# EAGLE design eNode3 (EAGLE 7.2.0)
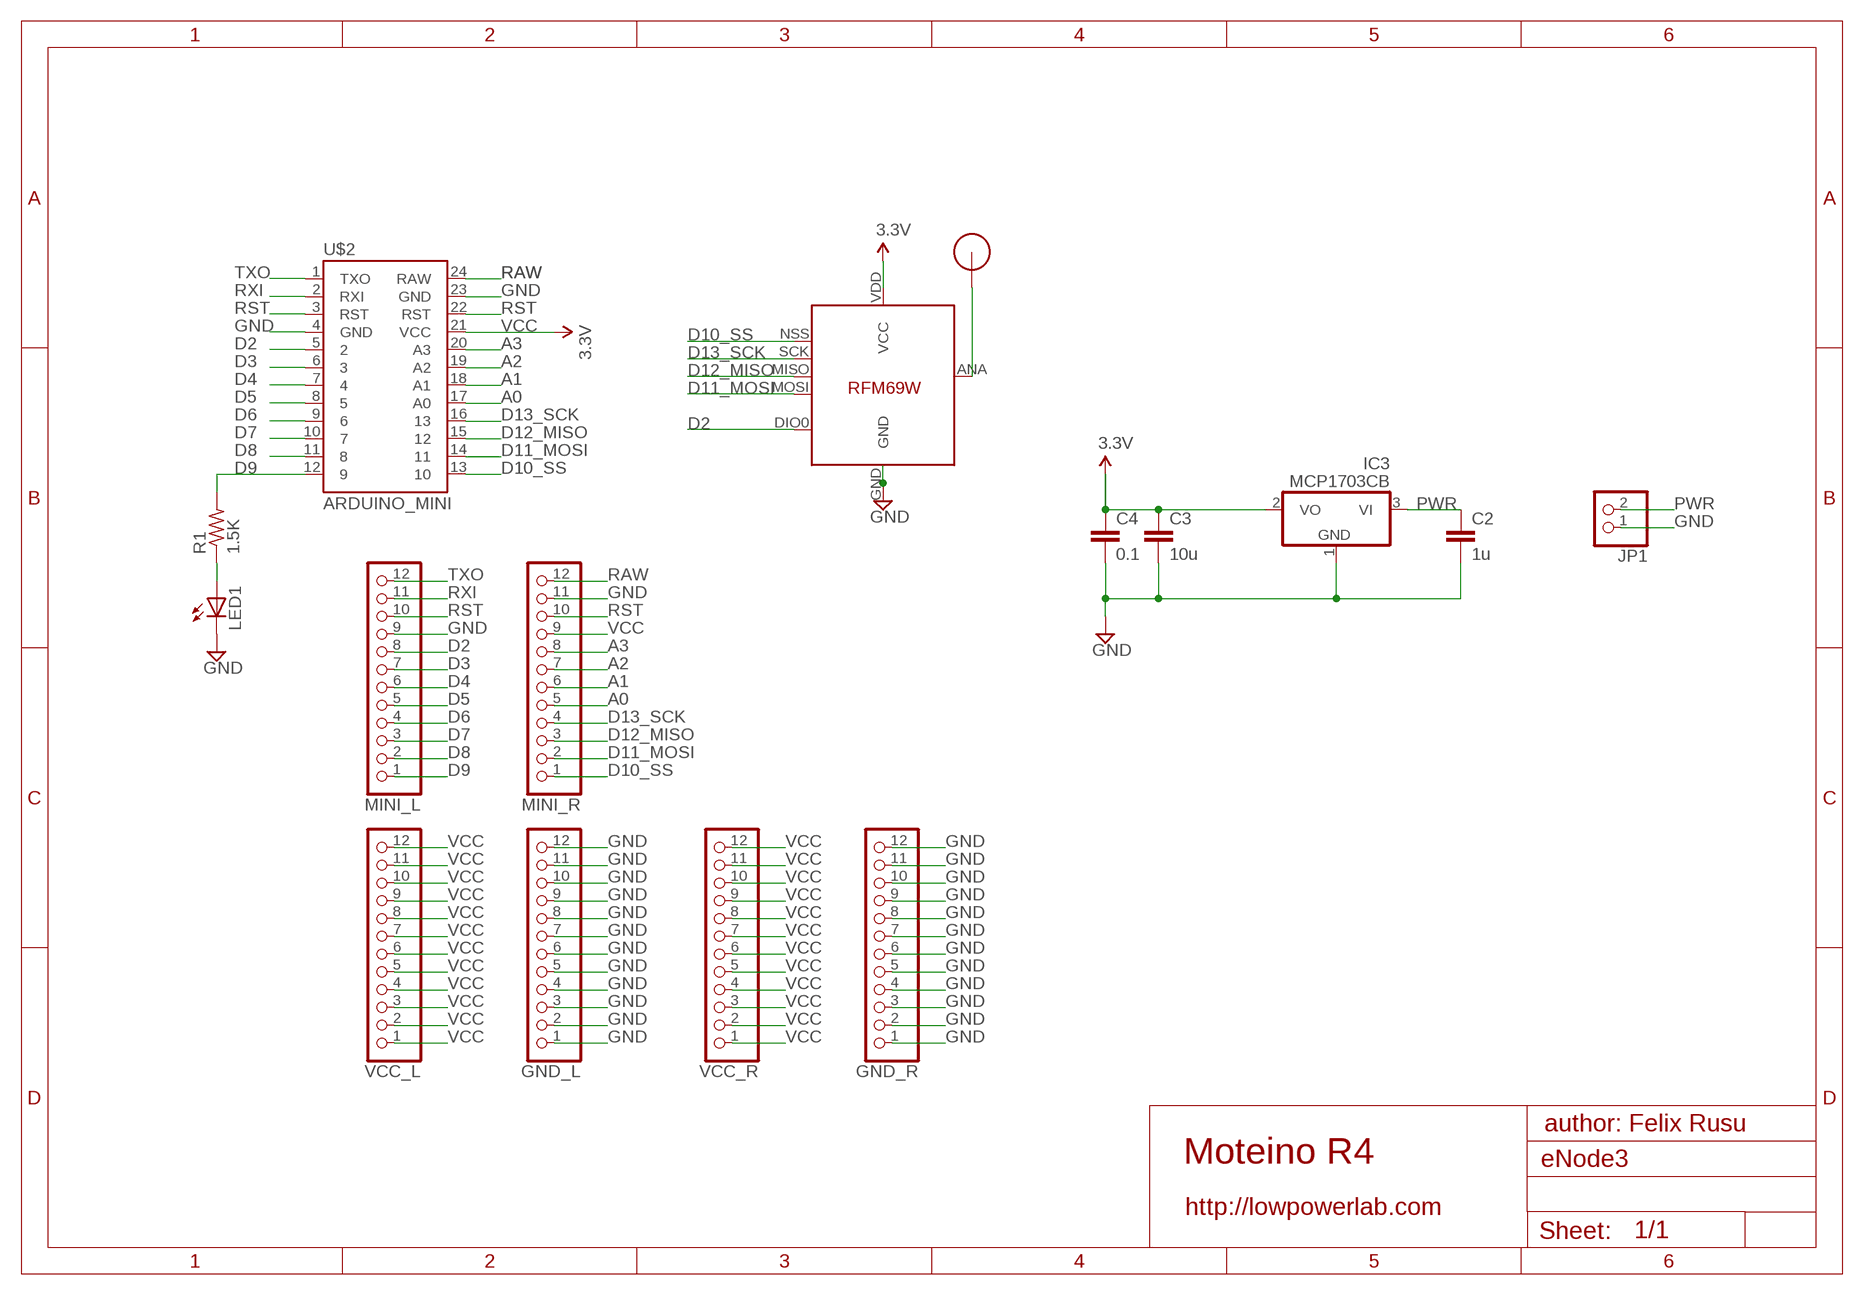
[diagram p0: schematic, sheet 1]

## Parts
C2  1u  CAP0603-CAP  [0603-CAP]
C3  10u  CAP0805-CAP  [0805-CAP]
C4  0.1  CAP0603-CAP  [0603-CAP]
GND_L  PINHD-1X12-CB  [1X12-CB]
GND_R  PINHD-1X12-CB  [1X12-CB]
IC3  MCP1703CB  [SOT23]
JP1  PINHD-1X2  [1X02]
LED1  LED3MM  [LED3MM]
MINI_L  PINHD-1X12-CB  [1X12-CB]
MINI_R  PINHD-1X12-CB  [1X12-CB]
R1  1.5K  R-US_R0805  [R0805]
U$1  RFM12B_ANTENNA  [RFM12B-ANTENNA]
U$2  ARDUINO_MINI  [ARDUINO_MINI]
U$5  RFM69  [RFM69W-MINPADS]
VCC_L  PINHD-1X12-CB  [1X12-CB]
VCC_R  PINHD-1X12-CB  [1X12-CB]

## Nets
A0: MINI_R.5 U$2.17(A0)
A1: MINI_R.6 U$2.18(A1)
A2: MINI_R.7 U$2.19(A2)
A3: MINI_R.8 U$2.20(A3)
D2: MINI_L.8 U$2.5 U$5.DIO0
D3: MINI_L.7 U$2.6
D4: MINI_L.6 U$2.7
D5: MINI_L.5 U$2.8
D6: MINI_L.4 U$2.9
D7: MINI_L.3 U$2.10
D8: MINI_L.2 U$2.11
D9: MINI_L.1 R1.2 U$2.12
D10_SS: MINI_R.1 U$2.13 U$5.NSS(SEL)
D11_MOSI: MINI_R.2 U$2.14 U$5.MOSI
D12_MISO: MINI_R.3 U$2.15 U$5.MISO
D13_SCK: MINI_R.4 U$2.16 U$5.SCK
GND [power]: C2.2 C3.2 C4.2 GND_L.1 GND_L.2 GND_L.3 GND_L.4 GND_L.5 GND_L.6 GND_L.7 GND_L.8 GND_L.9 GND_L.10 GND_L.11 GND_L.12 GND_R.1 GND_R.2 GND_R.3 GND_R.4 GND_R.5 GND_R.6 GND_R.7 GND_R.8 GND_R.9 GND_R.10 GND_R.11 GND_R.12 IC3.1(GND) JP1.1 LED1.K(C) MINI_L.9 MINI_R.11 U$2.4(GND) U$2.23(GND) U$5.GND
N$1: LED1.A R1.1
N$3: U$1.P$1 U$5.ANA(ANT)
PWR [power]: C2.1 IC3.3(VI) JP1.2
RAW: MINI_R.12 U$2.24(RAW)
RST: MINI_L.10 MINI_R.10 U$2.3(RST) U$2.22(RST)
RXI: MINI_L.11 U$2.2(RXI)
TXO: MINI_L.12 U$2.1(TXO)
VCC: C3.1 C4.1 IC3.2(VO) MINI_R.9 U$2.21(VCC) U$5.VDD(VCC) VCC_L.1 VCC_L.2 VCC_L.3 VCC_L.4 VCC_L.5 VCC_L.6 VCC_L.7 VCC_L.8 VCC_L.9 VCC_L.10 VCC_L.11 VCC_L.12 VCC_R.1 VCC_R.2 VCC_R.3 VCC_R.4 VCC_R.5 VCC_R.6 VCC_R.7 VCC_R.8 VCC_R.9 VCC_R.10 VCC_R.11 VCC_R.12 ; supply symbol labelled 3.3V

## Notes on the sheet
- author: Felix Rusu
- Moteino R4
- http://lowpowerlab.com

## Library data of the parts
C2-C4 = LowPowerLab:CAP: Capacitor Standard 0603 ceramic capacitor, and 0.1" leaded capacitor.
GND_L GND_R MINI_L MINI_R VCC_L VCC_R = adafruit:PINHD-1X12: PIN HEADER
IC3 = linear:MCP1703: 250 mA, 16V, Low Quiescent Current LDO Regulator Source: http://ww1.microchip.com/downloads/en/DeviceDoc/22049b.pdf
JP1 = pinhead:PINHD-1X2: PIN HEADER
LED1 = adafruit:LED: LED OSRAM: - CHIPLED LG R971, LG N971, LY N971, LG Q971, LY Q971, LO R971, LY R971 LH N974, LH R974 LS Q976, LO Q976, LY Q976 LO Q996 - Hyper CHIPLED LW Q18S LB Q993, LB Q99A, LB R99A - SideLED LS A670, LO A670, LY A670, LG A670, LP A670 LB A673, LV A673, LT A673, LW A673 LH A674 LY A675 LS A676, LA A676, LO A676, LY A676, LW A676 LS A679, LY A679, LG A679 - Hyper Micro SIDELED® LS Y876, LA Y876, LO Y876, LY Y876 LT Y87S - SmartLED LW L88C, LW L88S LB L89C, LB L89S, LG L890 LS L89K, LO L89K, LY L89K LS L896, LA L896, LO L896, LY L896 - TOPLED LS T670, LO T670, LY T670, LG T670, LP T670 LSG T670, LSP T670, LSY T670, LOP T670, LYG T670 LG T671, LOG T671, LSG T671 LB T673, LV T673, LT T673, LW T673 LH T674 LS T676, LA T676, LO T676, LY T676, LB T676, LH T676, LSB T676, LW T676 LB T67C, LV T67C, LT T67C, LS T67K, LO T67K, LY T67K, LW E67C LS E67B, LA E67B, LO E67B, LY E67B, LB E67C, LV E67C, LT E67C LW T67C LS T679, LY T679, LG T679 LS T770, LO T770, LY T770, LG T770, LP T770 LB T773, LV T773, LT T773, LW T773 LH T774 LS E675, LA E675, LY E675, LS T675 LS T776, LA T776, LO T776, LY T776, LB T776 LHGB T686 LT T68C, LB T68C - Hyper Mini TOPLED® LB M676 - Mini TOPLED Santana® LG M470 LS M47K, LO M47K, LY M47K Source: http://www.osram.convergy.de/
R1 = adafruit:R-US_: RESISTOR, American symbol
U$1 = LowPowerLab:RFM12B_ANTENNA
U$2 = SparkFun-Boards:ARDUINO_MINI: Arduino Pro Mini footprint
U$5 = LowPowerLab:RFM69

## Net classes
1 power: width 0.381 mm, clearance 0.254 mm

## Board
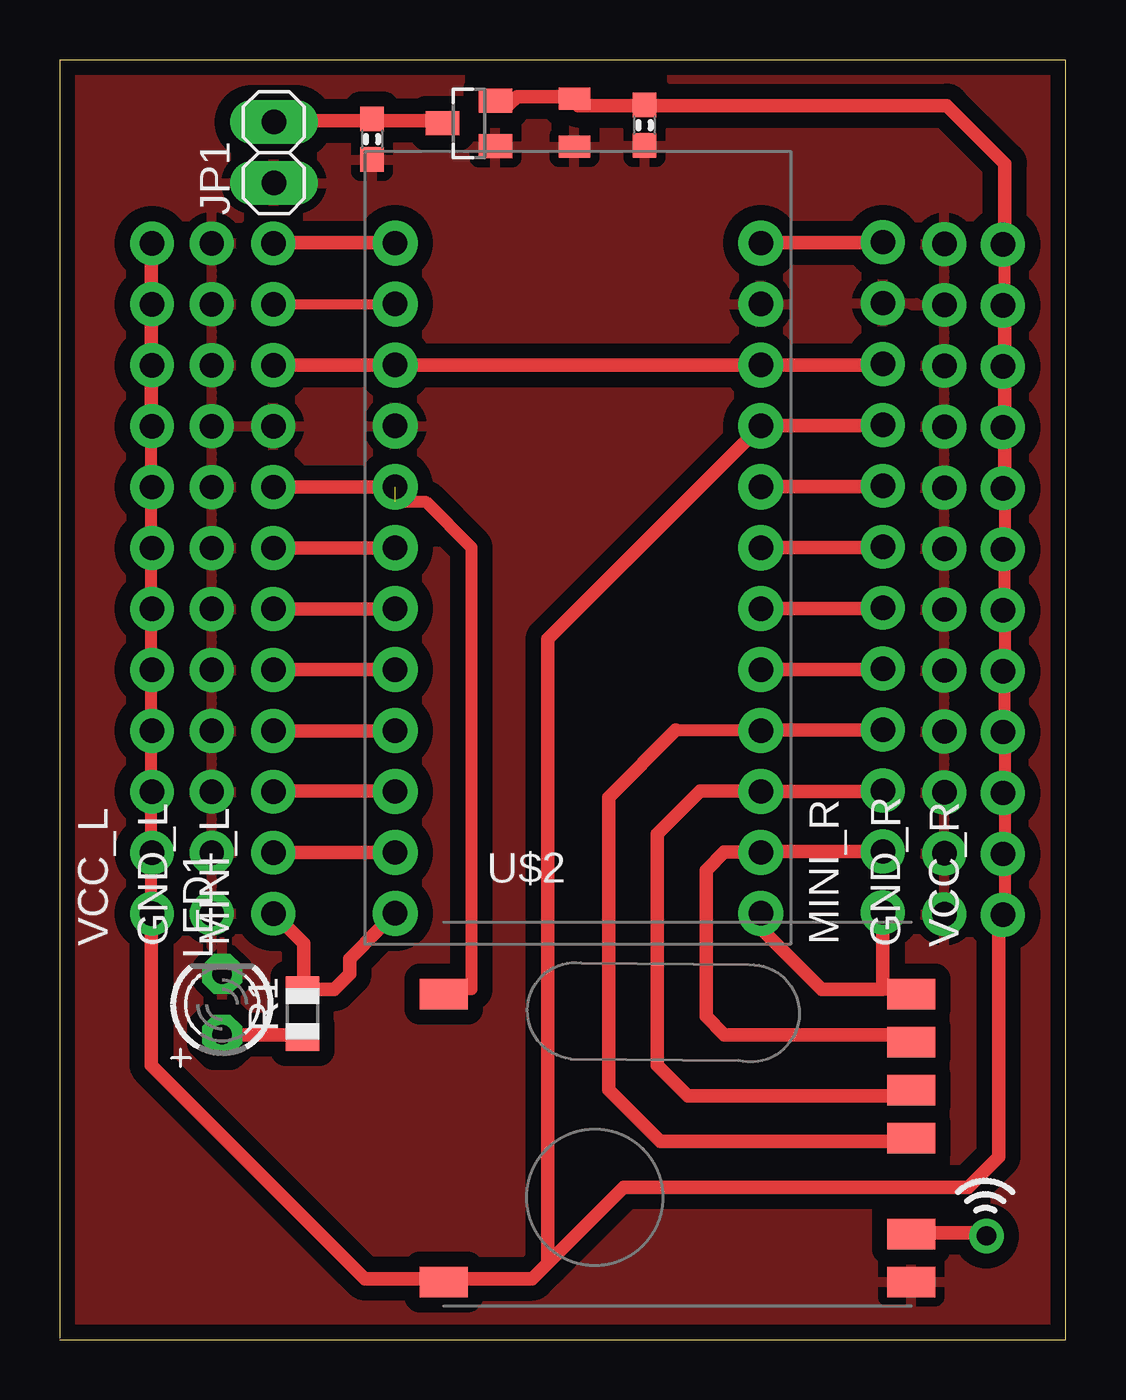
[diagram p1: board, top side]
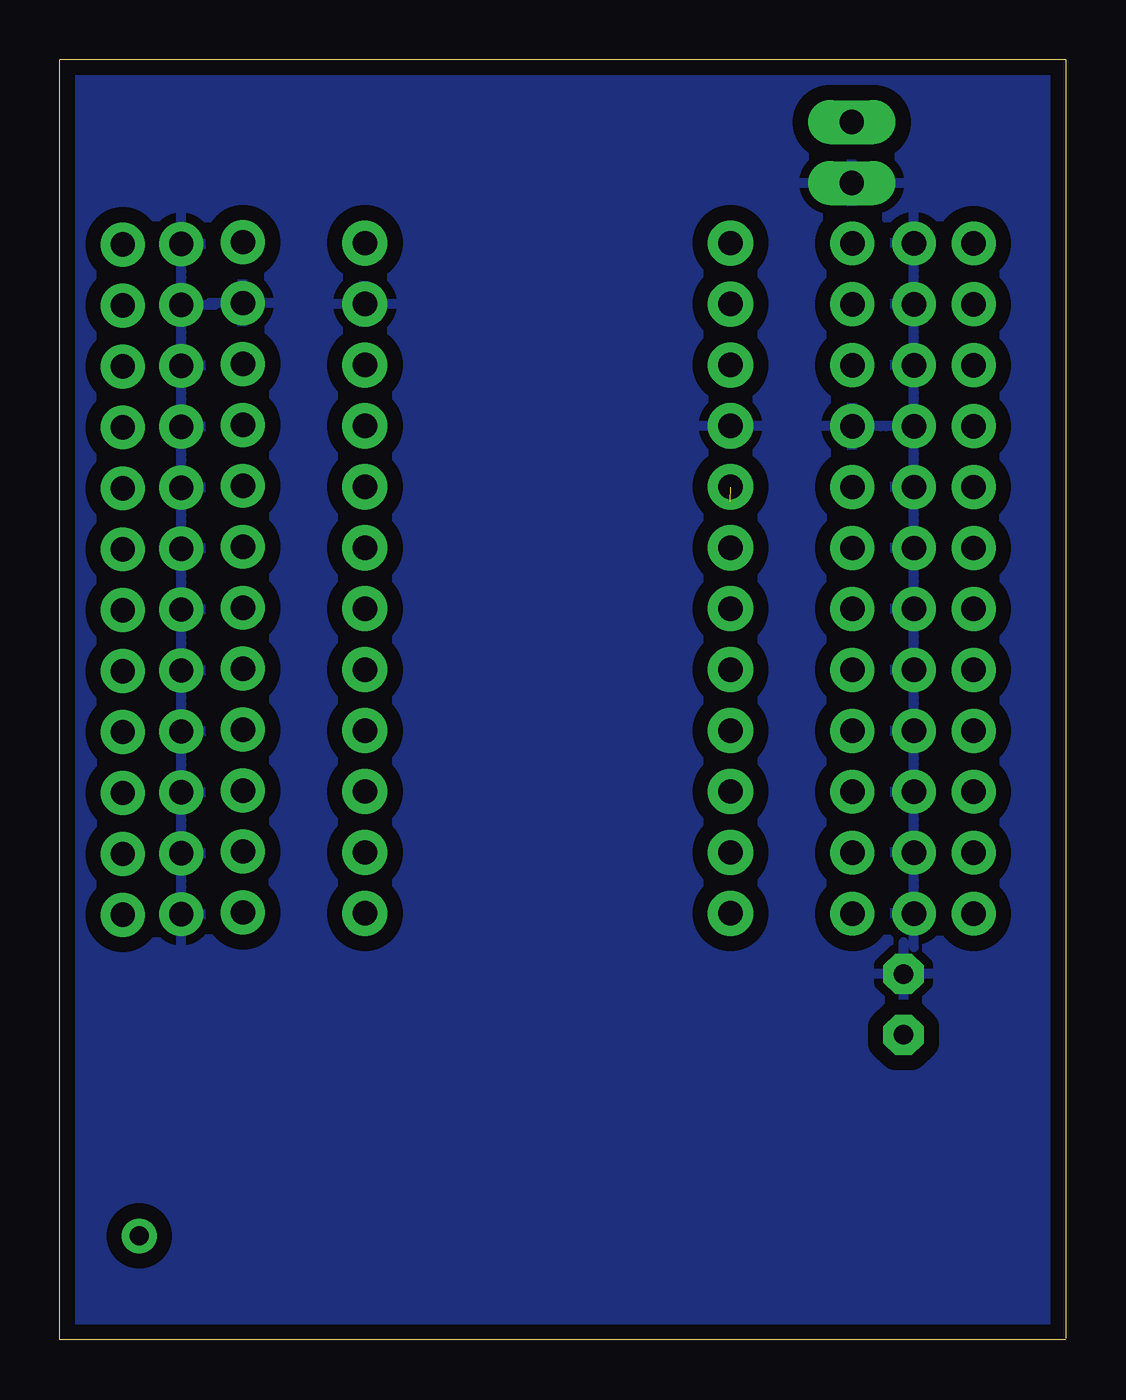
[diagram p2: board, bottom side, seen from below]

Size 41.91 x 53.34 mm. Coordinates in mm from the lower left corner, seen from the top.
Outline: 0,0.05 0,53.34 41.91,53.34 41.91,0 0,0
Copper layers (1*16): Top 0.035mm / dielectric 1.5mm / Bottom 0.035mm
Design rules "ITEADstudio_DRC *": minimum track width 20mil, minimum drill 20mil, track to track 25mil, track to pad 25mil, pad to pad 25mil, via to via 25mil, smd to smd 0mil, copper to edge 25mil, drill to drill 25mil, minimum pad ring 10mil, minimum via ring 6mil, stop-mask expansion 2mil, vias tented up to drill 100mil, thermal gap 15mil

### Footprints (pad centres in the part's own frame; a part is rotated, then mirrored left to right if it is on the bottom)
0603-CAP = smd 1.016 x 0.965: 1 -0.85,0; 2 0.85,0
0805-CAP = smd 0.902 x 1.3: 1 -1,0; 2 1,0
1X12-CB = drill 1.016 pad 1.778: 1 -13.97,0; 2 -11.43,0; 3 -8.89,0; 4 -6.35,0; 5 -3.81,0; 6 -1.27,0; 7 1.27,0; 8 3.81,0; 9 6.35,0; 10 8.89,0; 11 11.43,0; 12 13.97,0
SOT23 = smd 1 x 1.4: 1 -0.95,-1.1; 2 0.95,-1.1; 3 0,1.1
1X02 = drill 1.016 long: 1 -1.27,0; 2 1.27,0
LED3MM = drill 0.813 pad 1.676 octagon: A -1.27,0; K 1.27,0
R0805 = smd 1.1 x 1.4: 1 -1,0; 2 1,0
RFM12B-ANTENNA = drill 0.8 pad 1.422: P$1 0,0
ARDUINO_MINI = drill 1.016 pad 1.88: 1 -7.62,12.7; 2 -7.62,10.16; 3 -7.62,7.62; 4 -7.62,5.08; 5 -7.62,2.54; 6 -7.62,0; 7 -7.62,-2.54; 8 -7.62,-5.08; 9 -7.62,-7.62; 10 -7.62,-10.16; 11 -7.62,-12.7; 12 -7.62,-15.24; 13 7.62,-15.24; 14 7.62,-12.7; 15 7.62,-10.16; 16 7.62,-7.62; 17 7.62,-5.08; 18 7.62,-2.54; 19 7.62,0; 20 7.62,2.54; 21 7.62,5.08; 22 7.62,7.62; 23 7.62,10.16; 24 7.62,12.7
RFM69W-MINPADS = smd 2 x 1.27: ANA 8,-5; DIO0 -11.5,5; GND 8,-7; MISO 8,1; MOSI 8,3; NSS 8,5; SCK 8,-1; VDD -11.5,-7

### Placement (x,y rotation side)
C2  13,50.04 270 top
C3  21.44,50.72 270 top
C4  24.36,50.62 270 top
GND_L  6.32,31.72 90 top
GND_R  36.86,31.7 90 top
IC3  17.04,50.7 90 top
JP1  8.92,49.48 90 top
LED1  6.76,13.97 90 top
MINI_L  8.89,31.72 90 top
MINI_R  34.29,31.78 90 top
R1  10.11,13.59 90 top
U$1  38.61,4.32 0 top
U$2  21.59,33.01 0 top
U$5  27.48,9.4 0 top
VCC_L  3.84,31.72 90 top
VCC_R  39.29,31.67 90 top

### Tracks (layer width: path | path; a pad name or v marks a point on that pad's centre or on a via)
A0
  Top 0.406: 34.29,27.93 MINI_R.5
  Top 0.508: 34.29,27.94 MINI_R.5
  Top 0.559: U$2.17 34.29,27.93
A1
  Top 0.406: 34.29,30.48 MINI_R.6
  Top 0.508: U$2.18
  Top 0.559: U$2.18 34.29,30.48
A2
  Top 0.406: 34.29,33.01 MINI_R.7
  Top 0.559: U$2.19 34.29,33.01
A3
  Top 0.406: 34.29,35.56 MINI_R.8
  Top 0.508: U$2.20
  Top 0.559: U$2.20 34.29,35.56
D2  (1 unrouted)
  Top 0.406: 13.97,35.54 U$2.5
  Top 0.508: 13.97,34.93 15.24,34.93 17.14,33.02 17.14,14.6 16.51,14.6 U$5.DIO0
  Top 0.559: MINI_L.8 13.97,35.54
D3
  Top 0.406: 13.97,33 U$2.6
  Top 0.559: MINI_L.7 13.97,33
D4
  Top 0.406: 13.97,30.45 U$2.7
  Top 0.559: MINI_L.6 13.97,30.45
D5
  Top 0.508: 8.89,27.94 MINI_L.5 | 13.34,27.94 U$2.8
  Top 0.559: 8.89,27.94 13.34,27.94
D6
  Top 0.406: 13.97,25.38 U$2.9
  Top 0.559: MINI_L.4 13.97,25.38
D7
  Top 0.406: U$2.10
  Top 0.508: 8.89,22.86 MINI_L.3 | 13.34,22.86 U$2.10
  Top 0.559: 8.89,22.86 U$2.10
D8
  Top 0.406: 13.97,20.3 U$2.11
  Top 0.559: MINI_L.2 13.97,20.3
D9
  Top 0.508: 8.89,17.78 MINI_L.1 | 10.16,14.6 R1.2
  Top 0.559: 8.89,17.78 10.16,16.51 10.16,14.6 11.43,14.6 12.07,15.24 12.07,15.87 13.34,17.15 U$2.12
D10_SS
  Top 0.508: 34.29,14.6 34.92,14.6 U$5.NSS
  Top 0.559: MINI_R.1 34.29,14.6 31.75,14.6 29.21,17.15 U$2.13
D11_MOSI
  Top 0.406: 29.21,20.34 U$2.14
  Top 0.508: 34.92,12.7 U$5.MOSI | 28.57,20.32 U$2.14
  Top 0.559: MINI_R.2 29.21,20.34 | 34.92,12.7 27.69,12.7 26.92,13.46 26.92,19.56 27.69,20.32 28.57,20.32
D12_MISO
  Top 0.406: 34.29,22.85 MINI_R.3
  Top 0.508: 34.92,10.16 U$5.MISO | 28.57,22.86 U$2.15
  Top 0.559: U$2.15 34.29,22.85 | 34.92,10.16 26.16,10.16 24.89,11.43 24.89,21.08 26.67,22.86 28.57,22.86
D13_SCK
  Top 0.406: 34.29,25.4 MINI_R.4
  Top 0.508: 34.92,8.26 U$5.SCK | 28.57,25.4 28.7,25.4 | 28.7,25.4 U$2.16 | 25.65,25.4 28.69,25.4 28.7,25.4
  Top 0.559: U$2.16 34.29,25.4 | 34.92,8.26 25.02,8.26 22.86,10.41 22.86,22.61 25.65,25.4
GND
  pour Bottom (isolate 0.61): -1.91,55.55 -1.91,-3.3 44.3,-3.58 44.3,55.27
  pour Top (isolate 0.61): -1.88,55.47 -1.91,-3.3 44.12,-3.58 44.15,55.19
N$1
  Top 0.508: 6.99,12.7 LED1.A | 10.16,12.7 R1.1
  Top 0.559: 10.16,12.7 6.99,12.7
N$3
  Top 0.508: 35.56,4.45 U$5.ANA | 38.1,4.45 U$1.P$1
  Top 0.559: 38.1,4.45 35.56,4.45
PWR
  Top 0.508: 13.34,50.8 C2.1 12.7,50.8 | 15.88,50.8 IC3.3 | 8.89,50.8 JP1.2
  Top 0.559: 15.88,50.8 13.34,50.8 | 8.89,50.8 12.92,50.8 C2.1
RAW
  Top 0.406: 34.29,45.72 MINI_R.12
  Top 0.508: U$2.24
  Top 0.559: U$2.24 34.29,45.72
RST
  Top 0.406: 13.97,40.62 U$2.3 | 34.29,40.63 MINI_R.10
  Top 0.508: 34.29,40.64 MINI_R.10 | 28.57,40.64 U$2.22
  Top 0.559: MINI_L.10 13.97,40.62 | U$2.3 U$2.22 34.29,40.63
RXI
  Top 0.406: MINI_L.11 13.97,43.16 U$2.2
TXO
  Top 0.406: U$2.1
  Top 0.508: 8.89,45.72 MINI_L.12
  Top 0.559: 8.89,45.72 U$2.1
VCC
  Top 0.406: 34.29,38.1 MINI_R.9
  Top 0.508: 24.13,51.44 C4.1 24.77,51.44 | 21.59,51.44 C3.1 | 18.41,51.44 IC3.2 | 39.37,45.72 VCC_R.12 39.37,45.09 39.37,43.18 VCC_R.11 39.37,42.55 | 39.37,38.1 VCC_R.9 39.37,37.47 | 39.37,40.01 VCC_R.10 39.37,40.64 | 39.37,35.56 VCC_R.8 39.37,34.93 39.37,33.02 VCC_R.7 39.37,32.39 39.37,30.48 VCC_R.6 39.37,29.84 39.37,27.94 VCC_R.5 39.37,27.3 39.37,25.4 VCC_R.4 39.37,24.77 39.37,22.86 VCC_R.3 39.37,22.23 39.37,20.32 VCC_R.2 39.37,19.69 39.37,17.78 VCC_R.1 39.12,17.53 | U$2.21 | 3.81,40.01 VCC_L.10 3.81,40.64 | 3.81,38.1 VCC_L.9 3.81,37.47 3.81,35.56 VCC_L.8 3.81,34.93 3.81,33.02 VCC_L.7 3.81,32.39 3.81,30.48 VCC_L.6 3.81,29.84 3.81,27.94 VCC_L.5 3.81,27.3 3.81,25.4 VCC_L.4 3.81,24.77 3.81,22.86 VCC_L.3 3.81,22.23 3.81,20.32 VCC_L.2 3.81,19.69 3.81,17.78 VCC_L.1 3.81,17.15 | 3.81,42.55 VCC_L.11 3.81,43.18 | 3.81,45.09 VCC_L.12 | 15.88,2.54 U$5.VDD 16.51,2.54
  Top 0.559: 21.59,51.44 24.13,51.44 | 39.37,40.01 39.37,38.1 | 39.37,40.64 39.37,42.55 | 39.37,35.56 39.37,37.47 | 3.81,38.1 3.81,40.01 | 3.81,40.64 3.81,42.55 | 3.81,43.18 3.81,45.09 | 3.81,17.15 3.81,11.43 12.7,2.54 15.88,2.54 | 20.32,3.18 19.68,2.54 16.51,2.54 | U$2.21 34.29,38.1 | 20.32,3.18 20.32,29.2 U$2.21 | 20.32,3.18 23.5,6.35 37.85,6.35 39.12,7.62 39.12,17.53 | 39.37,45.72 39.37,49.02 36.96,51.44 24.77,51.44 | 18.41,51.44 18.67,51.44 19.05,51.82 21.34,51.82 C3.1

### Text on the board
tDocu: REG